# EAGLE design Amp (EAGLE 9.7.0)
SIM_ABSTOL: 1e-12; SIM_AC_SWEEP_TYPE: Dec; SIM_CHGTOL: 1e-15; SIM_GMIN: 1e-12; SIM_ITL1: 100; SIM_ITL2: 50; SIM_ITL4: 10; SIM_MAX_LIMIT: 2000; SIM_METHOD: TRAP; SIM_NUMPOINTS: 500; SIM_PIVREL: 1e-3; SIM_PIVTOL: 1e-13; SIM_RELTOL: 1e-3; SIM_RSHUNT: OFF; SIM_SRCSTEPS: 0; SIM_TEMPERATURE: 25.0; SIM_THEME: light; SIM_TRAN_AC_START: 1; SIM_TRTOL: 7; SIM_TYPE: Operating Point; SIM_VNTOL: 1e-6
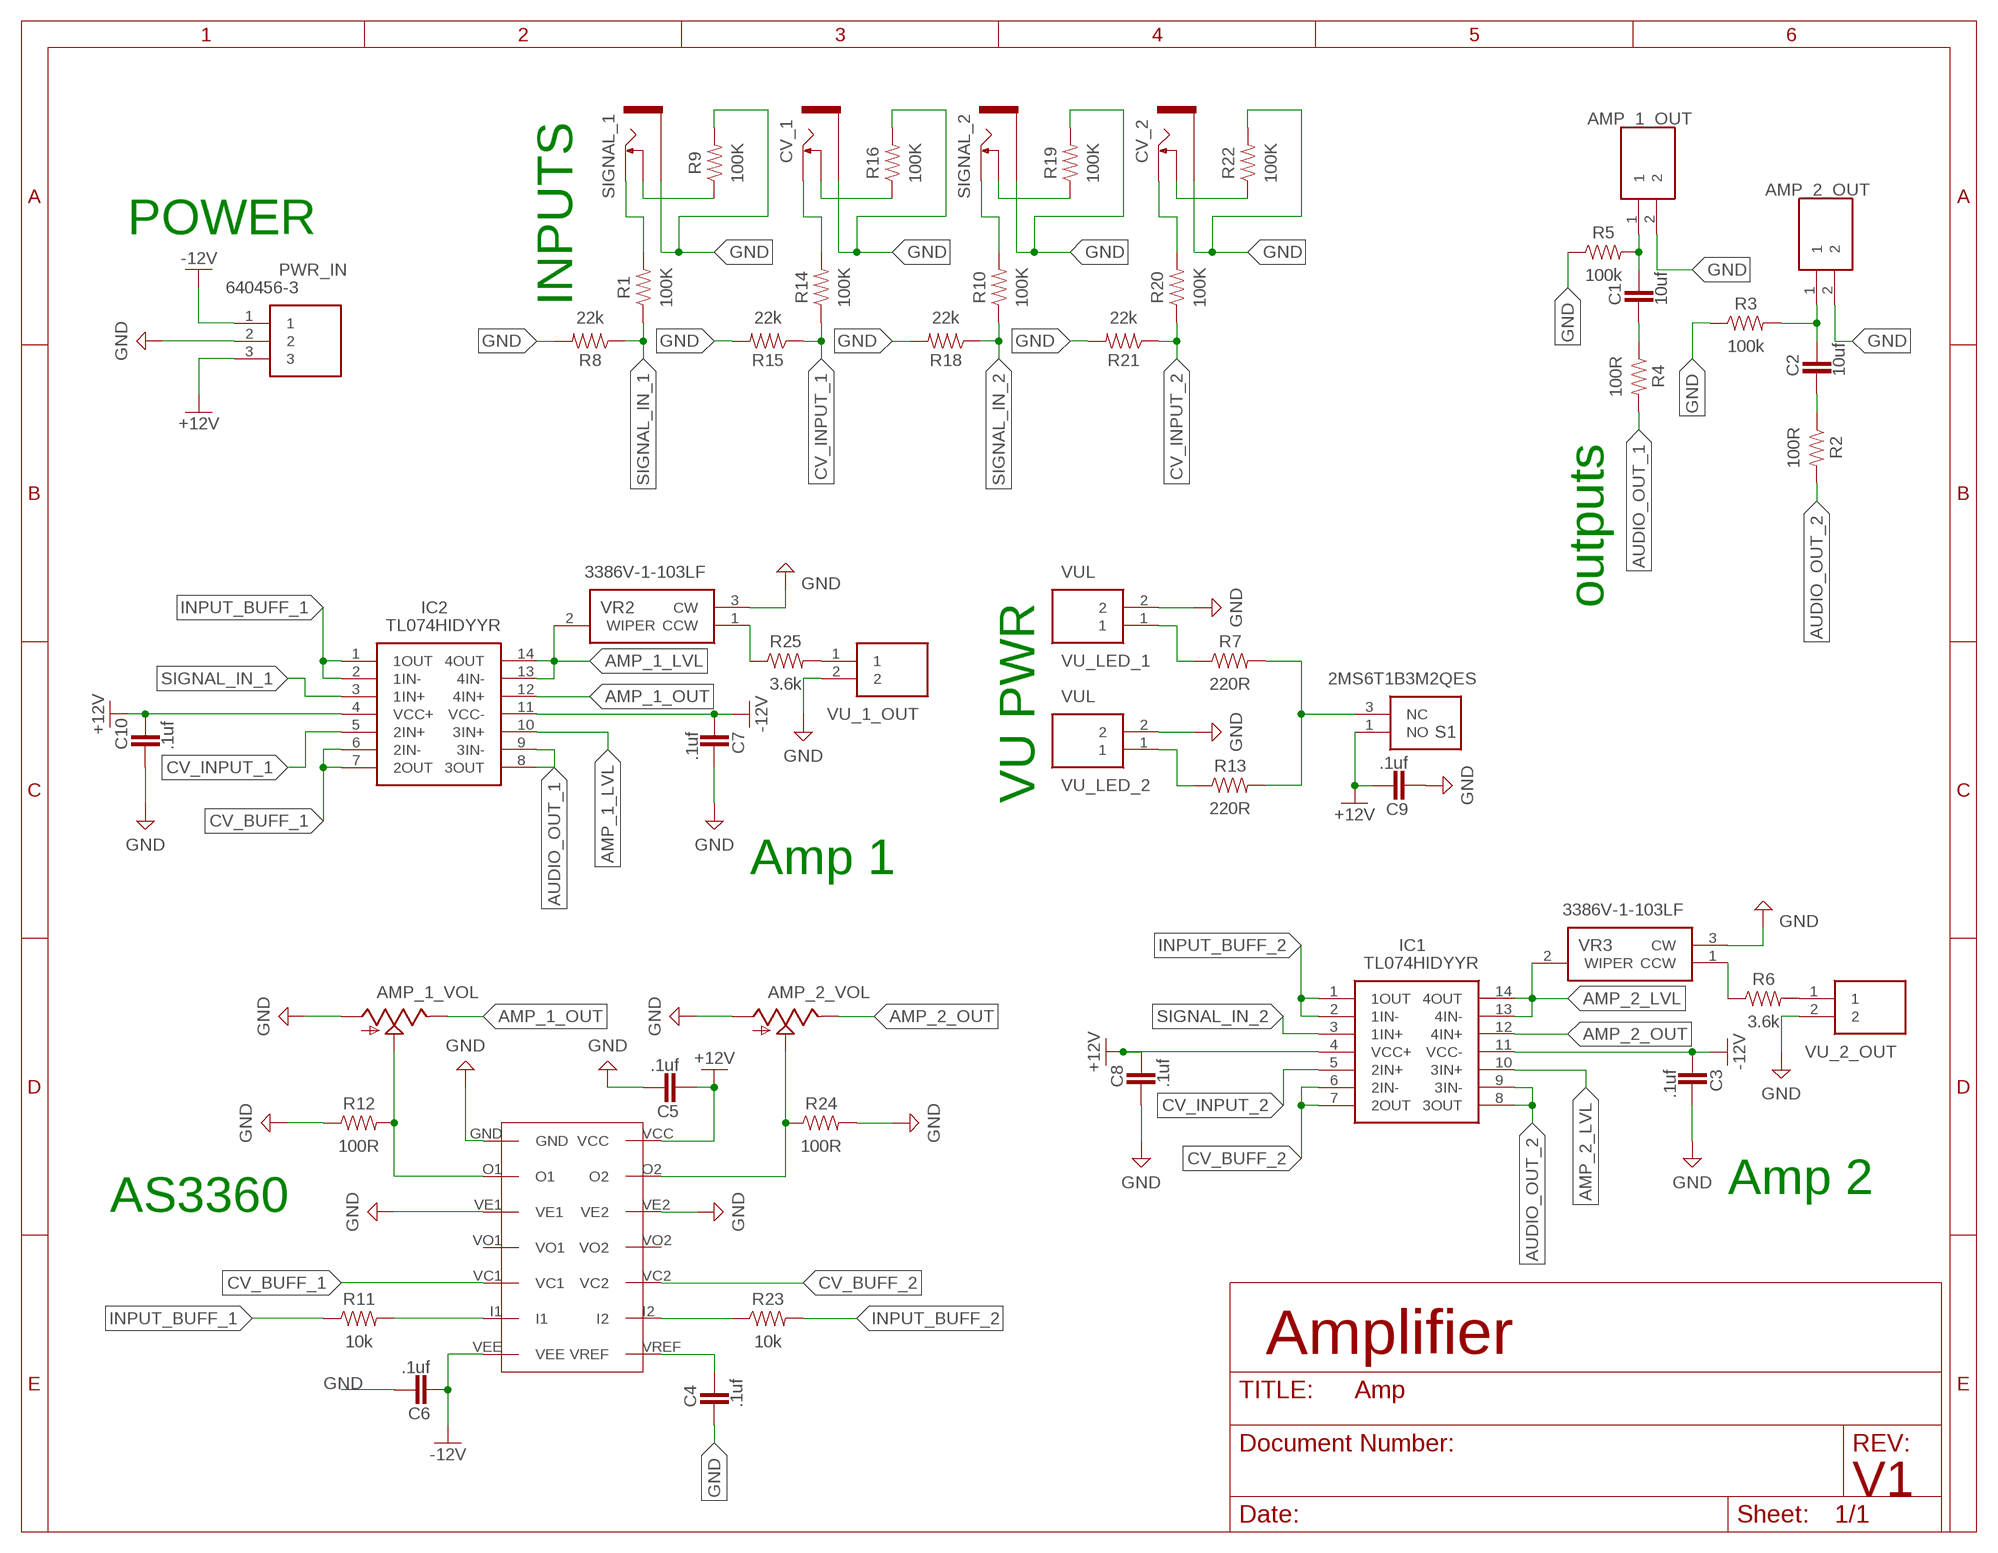
[diagram p0: schematic, sheet 1]

## Parts
AMP_1_OUT  OUT  640456-2  [SHDR2W66P0X254_1X2_508X572X104]
AMP_1_VOL  9MM_SNAP-IN_POT_  [9MM_SNAP-IN_POT]
AMP_2_OUT  OUT  640456-2  [SHDR2W66P0X254_1X2_508X572X104]
AMP_2_VOL  9MM_SNAP-IN_POT_  [9MM_SNAP-IN_POT]
C1  10uf  CAPACITOR_TANTALUM-1206(3216-METRIC)  [CAPM3216X180]
C2  10uf  CAPACITOR_TANTALUM-1206(3216-METRIC)  [CAPM3216X180]
C3  .1uf  CAPACITOR_CHIP-0402(1005-METRIC)  [CAPC1005X60]
C4  .1uf  CAPACITOR_CHIP-0402(1005-METRIC)  [CAPC1005X60]
C5  .1uf  CAPACITOR_CHIP-0402(1005-METRIC)  [CAPC1005X60]
C6  .1uf  CAPACITOR_CHIP-0402(1005-METRIC)  [CAPC1005X60]
C7  .1uf  CAPACITOR_CHIP-0402(1005-METRIC)  [CAPC1005X60]
C8  .1uf  CAPACITOR_CHIP-0402(1005-METRIC)  [CAPC1005X60]
C9  .1uf  CAPACITOR_CHIP-0402(1005-METRIC)  [CAPC1005X60]
C10  .1uf  CAPACITOR_CHIP-0402(1005-METRIC)  [CAPC1005X60]
CV_1  THONKICONNNEW  [WQP-PJ301M-12_JACK]
CV_2  THONKICONNNEW  [WQP-PJ301M-12_JACK]
IC1  TL074HIDYYR  [SOP50P326X110-14N]
IC2  TL074HIDYYR  [SOP50P326X110-14N]
PWR_IN  640456-3  [HDRV3W107P0X254_1X3_762X572X10]
R1  100K  R-US_CHIP-0402(1005-METRIC)  [RESC1005X40]
R2  100R  R-US_CHIP-0402(1005-METRIC)  [RESC1005X40]
R3  100k  R-US_CHIP-0402(1005-METRIC)  [RESC1005X40]
R4  100R  R-US_CHIP-0402(1005-METRIC)  [RESC1005X40]
R5  100k  R-US_CHIP-0402(1005-METRIC)  [RESC1005X40]
R6  3.6k  R-US_CHIP-0402(1005-METRIC)  [RESC1005X40]
R7  220R  R-US_CHIP-0402(1005-METRIC)  [RESC1005X40]
R8  22k  R-US_CHIP-0402(1005-METRIC)  [RESC1005X40]
R9  100K  R-US_CHIP-0402(1005-METRIC)  [RESC1005X40]
R10  100K  R-US_CHIP-0402(1005-METRIC)  [RESC1005X40]
R11  10k  R-US_CHIP-0402(1005-METRIC)  [RESC1005X40]
R12  100R  R-US_CHIP-0402(1005-METRIC)  [RESC1005X40]
R13  220R  R-US_CHIP-0402(1005-METRIC)  [RESC1005X40]
R14  100K  R-US_CHIP-0402(1005-METRIC)  [RESC1005X40]
R15  22k  R-US_CHIP-0402(1005-METRIC)  [RESC1005X40]
R16  100K  R-US_CHIP-0402(1005-METRIC)  [RESC1005X40]
R18  22k  R-US_CHIP-0402(1005-METRIC)  [RESC1005X40]
R19  100K  R-US_CHIP-0402(1005-METRIC)  [RESC1005X40]
R20  100K  R-US_CHIP-0402(1005-METRIC)  [RESC1005X40]
R21  22k  R-US_CHIP-0402(1005-METRIC)  [RESC1005X40]
R22  100K  R-US_CHIP-0402(1005-METRIC)  [RESC1005X40]
R23  10k  R-US_CHIP-0402(1005-METRIC)  [RESC1005X40]
R24  100R  R-US_CHIP-0402(1005-METRIC)  [RESC1005X40]
R25  3.6k  R-US_CHIP-0402(1005-METRIC)  [RESC1005X40]
S1  2MS6T1B3M2QES  [2MS6T1B3M2QES]
SIGNAL_1  THONKICONNNEW  [WQP-PJ301M-12_JACK]
SIGNAL_2  THONKICONNNEW  [WQP-PJ301M-12_JACK]
U$1  AS3360  AS33603360  [AS3360]
VR2  3386V-1-103LF  [3386V1103LF]
VR3  3386V-1-103LF  [3386V1103LF]
VU_1_OUT  VUO  640456-2  [SHDR2W66P0X254_1X2_508X572X104]
VU_2_OUT  VUO  640456-2  [SHDR2W66P0X254_1X2_508X572X104]
VU_LED_1  VUL  640456-2  [SHDR2W66P0X254_1X2_508X572X104]
VU_LED_2  VUL  640456-2  [SHDR2W66P0X254_1X2_508X572X104]

## Nets
+12V: C5.2 C8.1 C9.1 C10.1 IC1.4(VCC+) IC2.4(VCC+) PWR_IN.3 S1.1(NO) U$1.VCC
-12V: C3.2 C6.2 C7.2 IC1.11(VCC-) IC2.11(VCC-) PWR_IN.1 U$1.VEE
AMP_1_LVL: IC2.10(3IN+) IC2.13(4IN-) IC2.14(4OUT) VR2.2(WIPER)
AMP_1_OUT: AMP_1_VOL.2(S) AMP_1_VOL.3(E) IC2.12(4IN+) R12.2 U$1.O1
AMP_2_LVL: IC1.10(3IN+) IC1.13(4IN-) IC1.14(4OUT) VR3.2(WIPER)
AMP_2_OUT: AMP_2_VOL.2(S) AMP_2_VOL.3(E) IC1.12(4IN+) R24.1 U$1.O2
AUDIO_OUT_1: IC2.8(3OUT) IC2.9(3IN-) R4.2
AUDIO_OUT_2: IC1.8(3OUT) IC1.9(3IN-) R2.2
CV_BUFF_1: IC2.6(2IN-) IC2.7(2OUT) U$1.VC1
CV_BUFF_2: IC1.6(2IN-) IC1.7(2OUT) U$1.VC2
CV_INPUT_1: IC2.5(2IN+) R14.1 R15.1
CV_INPUT_2: IC1.5(2IN+) R20.1 R21.1
GND: AMP_1_OUT.2 AMP_1_VOL.1(A) AMP_2_OUT.2 AMP_2_VOL.1(A) C3.1 C4.2 C5.1 C6.1 C7.1 C8.2 C9.2 C10.2 CV_1.P$3_SLEEVE(SLEEVE) CV_2.P$3_SLEEVE(SLEEVE) PWR_IN.2 R3.1 R5.1 R8.2 R9.2 R12.1 R15.2 R16.2 R18.2 R19.2 R21.2 R22.2 R24.2 SIGNAL_1.P$3_SLEEVE(SLEEVE) SIGNAL_2.P$3_SLEEVE(SLEEVE) U$1.GND U$1.VE1 U$1.VE2 VR2.3(CW) VR3.3(CW) VU_1_OUT.2 VU_2_OUT.2 VU_LED_1.2 VU_LED_2.2
INPUT_BUFF_1: IC2.1(1OUT) IC2.2(1IN-) R11.1
INPUT_BUFF_2: IC1.1(1OUT) IC1.2(1IN-) R23.2
N$1: AMP_2_OUT.1 C2.1 R3.2
N$2: AMP_1_OUT.1 C1.1 R5.2
N$3: C1.2 R4.1
N$4: C2.2 R2.1
N$5: R13.1 VU_LED_2.1
N$6: R7.1 VU_LED_1.1
N$7: C4.1 U$1.VREF
N$8: R6.1 VR3.1(CCW)
N$9: R6.2 VU_2_OUT.1
N$10: R11.2 U$1.I1
N$12: R10.2 SIGNAL_2.P$1_TIP(TIP)
N$13: R1.2 SIGNAL_1.P$1_TIP(TIP)
N$14: R9.1 SIGNAL_1.P$2_SWITCH(SWITCH)
N$15: CV_1.P$1_TIP(TIP) R14.2
N$16: CV_1.P$2_SWITCH(SWITCH) R16.1
N$17: R19.1 SIGNAL_2.P$2_SWITCH(SWITCH)
N$18: CV_2.P$1_TIP(TIP) R20.2
N$19: CV_2.P$2_SWITCH(SWITCH) R22.1
N$20: R23.1 U$1.I2
N$21: R7.2 R13.2 S1.3(NC)
N$24: R25.2 VU_1_OUT.1
N$25: R25.1 VR2.1(CCW)
SIGNAL_IN_1: IC2.3(1IN+) R1.1 R8.1
SIGNAL_IN_2: IC1.3(1IN+) R10.1 R18.1
Unconnected: U$1.VO1 U$1.VO2

## Notes on the sheet
- POWER
- INPUTS
- outputs
- VU PWR
- Amp 1
- Amp 2
- AS3360
- Amplifier
- V1

## Library data of the parts
AMP_1_OUT AMP_2_OUT = 640456-2:640456-2: Body Features: Primary Product Color Natural | Configuration Features: Number of Positions 2 | Number of Columns 2 | PCB Mount Orientation Vertical | Number of Rows 1 | Contact Features: Contact Mating Area Length 7.49 MM | Contact Shape & Form Square | Contact Layout Inline | Contact Mating Area Plating Material Thickness 3.81 MICM | Contact Mating Area Plating Material Thickness 150 MICIN | Contact Underplating Material Thickness 1.27 MICM | Contact Mating Area Length .295 INCH | PCB Contact Termination A Source: Datasheet <http://www.te.com/commerce/DocumentDelivery/DDEController?Action=showdoc&DocId=Customer Drawing640456W3pdfEnglishENG_CD_640456_W3.pdf640456-2>; DESCRIPTION: Body Features: Primary Product Color Natural | Configuration Features: Number of Positions 2 | Number of Columns 2 | PCB Mount Orientation Vertical | Number of Rows 1 | Contact Features: Contact Mating Area Length 7.49 MM | Contact Shape & Form Square | Contact Layout Inline | Contact Mating Area Plating Material Thickness 3.81 MICM | Contact Mating Area Plating Material Thickness 150 MICIN | Contact Underplating Material Thickness 1.27 MICM | Contact Mating Area Length .295 INCH | PCB Contact Termination A; HEIGHT: 10.414mm; MANUFACTURER_NAME: TE Connectivity; MANUFACTURER_PART_NUMBER: 640456-2; MOUSER_PART_NUMBER: 571-6404562; MOUSER_PRICE-STOCK: https://www.mouser.co.uk/ProductDetail/TE-Connectivity-AMP/640456-2?qs=%2F35zJ5USjomRu3EJQJgZCQ%3D%3D; SPICEMODEL: OutputJack; SPICEMODELTEXT: *\n.subckt OutputJack 1 2\nR1 1 1_dummy 1m\nR2 2 2_dummy 1m\n.ends OutputJack; SPICEPREFIX: X
AMP_1_VOL AMP_2_VOL = MusicThingModular:9MM_SNAP-IN_POT: 9mm vertical snap-in pot, Alpha / Panasonic style; SPICEMODEL: POT10K; SPICEMODELTEXT: *\n.subckt POT10K 1 2 3\nRtop 1 2 5k\nRbot 2 3 5k\n.ends POT10K; SPICEPREFIX: X
C1-C10 = Tinkercad:CAPACITOR: Capacitor - Generic; CATEGORY: Capacitor
CV_1 CV_2 SIGNAL_1 SIGNAL_2 = MusicThingModular:THONKICONN: 3.5mm socket for Eurorack modular synths
IC1 IC2 = TL074HIDYYR:TL074HIDYYR: Operational Amplifiers - Op Amps Quad, 40-V, 5-MHz, 4-mV offset voltage, 20-V/us, In to V+ op amp with -40 C to 125 C operation Source: Datasheet <https://www.ti.com/lit/ds/symlink/tl074.pdf?HQS=dis-mous-null-mousermode-dsf-pf-null-wwe&ts=1653289518838&ref_url=https%3A%2F%2Fwww.mouser.es%2F>; DESCRIPTION: Operational Amplifiers - Op Amps Quad, 40-V, 5-MHz, 4-mV offset voltage, 20-V/us, In to V+ op amp with -40 C to 125 C operation; HEIGHT: 1.1mm; MANUFACTURER_NAME: Texas Instruments; MANUFACTURER_PART_NUMBER: TL074HIDYYR; MOUSER_PART_NUMBER: 595-TL074HIDYYR; MOUSER_PRICE-STOCK: https://www.mouser.co.uk/ProductDetail/Texas-Instruments/TL074HIDYYR?qs=Li%252BoUPsLEnudP2MOdP5hYw%3D%3D
PWR_IN = 640456-3:640456-3: Body Features: Primary Product Color Natural | Configuration Features: Number of Positions 3 | PCB Mount Orientation Vertical | Number of Rows 1 | Contact Features: Contact Current Rating (Max) 5 AMP | Contact Mating Area Plating Material Tin | Contact Underplating Material Nickel | PCB Contact Termination Area Plating Material Tin | Contact Mating Area Length 7.49 MM | Contact Underplating Material Thickness 50 MICIN | Contact Layout Inline | Contact Mating Area Length .295 INCH | Contact Base Material Cop Source: Datasheet <http://www.te.com/commerce/DocumentDelivery/DDEController?Action=showdoc&DocId=Customer Drawing640456W3pdfEnglishENG_CD_640456_W3.pdf640456-3>; DESCRIPTION: Body Features: Primary Product Color Natural | Configuration Features: Number of Positions 3 | PCB Mount Orientation Vertical | Number of Rows 1 | Contact Features: Contact Current Rating (Max) 5 AMP | Contact Mating Area Plating Material Tin | Contact Underplating Material Nickel | PCB Contact Termination Area Plating Material Tin | Contact Mating Area Length 7.49 MM | Contact Underplating Material Thickness 50 MICIN | Contact Layout Inline | Contact Mating Area Length .295 INCH | Contact Base Material Cop; HEIGHT: 10.795mm; MANUFACTURER_NAME: TE Connectivity; MANUFACTURER_PART_NUMBER: 640456-3; MOUSER_PART_NUMBER: 571-6404563; MOUSER_PRICE-STOCK: https://www.mouser.co.uk/ProductDetail/TE-Connectivity-AMP/640456-3?qs=%2F35zJ5USjonzBh%2Fz7jaWrQ%3D%3D
R1-R16 R18-R25 = Resistor:R-US: Resistor Fixed - ANSI; CATEGORY: Resistors; DESCRIPTION: Chip Resistor 1.05 X 0.54 X 0.40 mm body 0402(1005-METRIC) Package; PACKAGE_SIZE: 0402; PACKAGE_TYPE: SMD
S1 = 2MS6T1B3M2QES:2MS6T1B3M2QES: Toggle Switches SPST 2-4VDC , 1,000 M , OFF-ON 20 mmax , -40C to 85C Source: Datasheet <https://www.mouser.de/datasheet/2/979/Dailywell_01132020_2M_Series-1708785.pdf>; DESCRIPTION: Toggle Switches SPST 2-4VDC , 1,000 M , OFF-ON 20 mmax , -40C to 85C; HEIGHT: 23.63mm; MANUFACTURER_NAME: Dailywell; MANUFACTURER_PART_NUMBER: 2MS6T1B3M2QES; MOUSER_PART_NUMBER: 118-2MS6T1B3M2QES; MOUSER_PRICE-STOCK: https://www.mouser.co.uk/ProductDetail/Dailywell/2MS6T1B3M2QES?qs=B6kkDfuK7%2FCLnLIcqzvQEQ%3D%3D
U$1 = DIP762W53P254L1969H508Q14B:AS3360; SPICEMODEL: AS3360; SPICEMODELTEXT: *\n.subckt AS3360 1 2 3 4 5 6 7 8 9 10 11 12 13 14\n* Pins:\n* 1 = VE (−V)\n* 2 = IIN1\n* 3 = VREF\n* 4 = VO1\n* 5 = IO1\n* 6 = VC1\n* 7 = NC\n* 8 = VC2\n* 9 = IO2\n*10 = VO2\n*11 = VREF\n*12 = IIN2\n*13 = VE\n*14 = VS (+V)\n* Simulate left-side VCA (channel 1)\nGvca1 4 0 VALUE = { V(2) * V(6) } ; VO1 = IIN1 × VC1\n* Dummy resistors for unused pins\nRnc 7 0 1Meg\nRvc2 8 0 1Meg\nRio2 9 0 1Meg\nRvo2 10 0 1Meg\nRi2 12 0 1Meg\nRve1 1 0 1Meg\nRve2 13 0 1Meg\nRvs 14 0 1Meg\nRref1 3 0 1Meg\nRref2 11 0 1Meg\nRout1 5 0 1Meg ; IO1 not used in this sim\n.ends AS3360; SPICEPREFIX: X
VR2 VR3 = 3386V-1-103LF:3386V-1-103LF: Bourns 3386V Series Cermet Potentiometer, 10k, +/-10%, 0.5W, +/-100ppm/C, Through Hole Source: Datasheet <https://www.bourns.com/pdfs/3386.pdf>; DESCRIPTION: Bourns 3386V Series Cermet Potentiometer, 10k, +/-10%, 0.5W, +/-100ppm/C, Through Hole; HEIGHT: 9.78mm; MANUFACTURER_NAME: Bourns; MANUFACTURER_PART_NUMBER: 3386V-1-103LF; MOUSER_PART_NUMBER: 652-3386V-1-103LF; MOUSER_PRICE-STOCK: https://www.mouser.co.uk/ProductDetail/Bourns/3386V-1-103LF?qs=67cj6OzW39gv7HpWJ2tIkw%3D%3D; SPICEMODEL: POT10K; SPICEMODELTEXT: *\n.subckt POT10K 1 2 3\nRtop 1 2 5k\nRbot 2 3 5k\n.ends POT10K; SPICEPREFIX: X
VU_1_OUT VU_2_OUT = 640456-2:640456-2: Body Features: Primary Product Color Natural | Configuration Features: Number of Positions 2 | Number of Columns 2 | PCB Mount Orientation Vertical | Number of Rows 1 | Contact Features: Contact Mating Area Length 7.49 MM | Contact Shape & Form Square | Contact Layout Inline | Contact Mating Area Plating Material Thickness 3.81 MICM | Contact Mating Area Plating Material Thickness 150 MICIN | Contact Underplating Material Thickness 1.27 MICM | Contact Mating Area Length .295 INCH | PCB Contact Termination A Source: Datasheet <http://www.te.com/commerce/DocumentDelivery/DDEController?Action=showdoc&DocId=Customer Drawing640456W3pdfEnglishENG_CD_640456_W3.pdf640456-2>; DESCRIPTION: Body Features: Primary Product Color Natural | Configuration Features: Number of Positions 2 | Number of Columns 2 | PCB Mount Orientation Vertical | Number of Rows 1 | Contact Features: Contact Mating Area Length 7.49 MM | Contact Shape & Form Square | Contact Layout Inline | Contact Mating Area Plating Material Thickness 3.81 MICM | Contact Mating Area Plating Material Thickness 150 MICIN | Contact Underplating Material Thickness 1.27 MICM | Contact Mating Area Length .295 INCH | PCB Contact Termination A; HEIGHT: 10.414mm; MANUFACTURER_NAME: TE Connectivity; MANUFACTURER_PART_NUMBER: 640456-2; MOUSER_PART_NUMBER: 571-6404562; MOUSER_PRICE-STOCK: https://www.mouser.co.uk/ProductDetail/TE-Connectivity-AMP/640456-2?qs=%2F35zJ5USjomRu3EJQJgZCQ%3D%3D; SPICEMODEL: j5; SPICEMODELTEXT: *\n.subckt j5 1 2\nR1 1 1_dummy 1m\nR2 2 2_dummy 1m\n.ends j5; SPICEPREFIX: X
VU_LED_1 VU_LED_2 = 640456-2:640456-2: Body Features: Primary Product Color Natural | Configuration Features: Number of Positions 2 | Number of Columns 2 | PCB Mount Orientation Vertical | Number of Rows 1 | Contact Features: Contact Mating Area Length 7.49 MM | Contact Shape & Form Square | Contact Layout Inline | Contact Mating Area Plating Material Thickness 3.81 MICM | Contact Mating Area Plating Material Thickness 150 MICIN | Contact Underplating Material Thickness 1.27 MICM | Contact Mating Area Length .295 INCH | PCB Contact Termination A Source: Datasheet <http://www.te.com/commerce/DocumentDelivery/DDEController?Action=showdoc&DocId=Customer Drawing640456W3pdfEnglishENG_CD_640456_W3.pdf640456-2>; DESCRIPTION: Body Features: Primary Product Color Natural | Configuration Features: Number of Positions 2 | Number of Columns 2 | PCB Mount Orientation Vertical | Number of Rows 1 | Contact Features: Contact Mating Area Length 7.49 MM | Contact Shape & Form Square | Contact Layout Inline | Contact Mating Area Plating Material Thickness 3.81 MICM | Contact Mating Area Plating Material Thickness 150 MICIN | Contact Underplating Material Thickness 1.27 MICM | Contact Mating Area Length .295 INCH | PCB Contact Termination A; HEIGHT: 10.414mm; MANUFACTURER_NAME: TE Connectivity; MANUFACTURER_PART_NUMBER: 640456-2; MOUSER_PART_NUMBER: 571-6404562; MOUSER_PRICE-STOCK: https://www.mouser.co.uk/ProductDetail/TE-Connectivity-AMP/640456-2?qs=%2F35zJ5USjomRu3EJQJgZCQ%3D%3D; SPICEMODEL: j6; SPICEMODELTEXT: *\n.subckt HEADER2 1 2\nR1 1 1_dummy 1m\nR2 2 2_dummy 1m\n.ends HEADER2; SPICEPREFIX: X

## Board
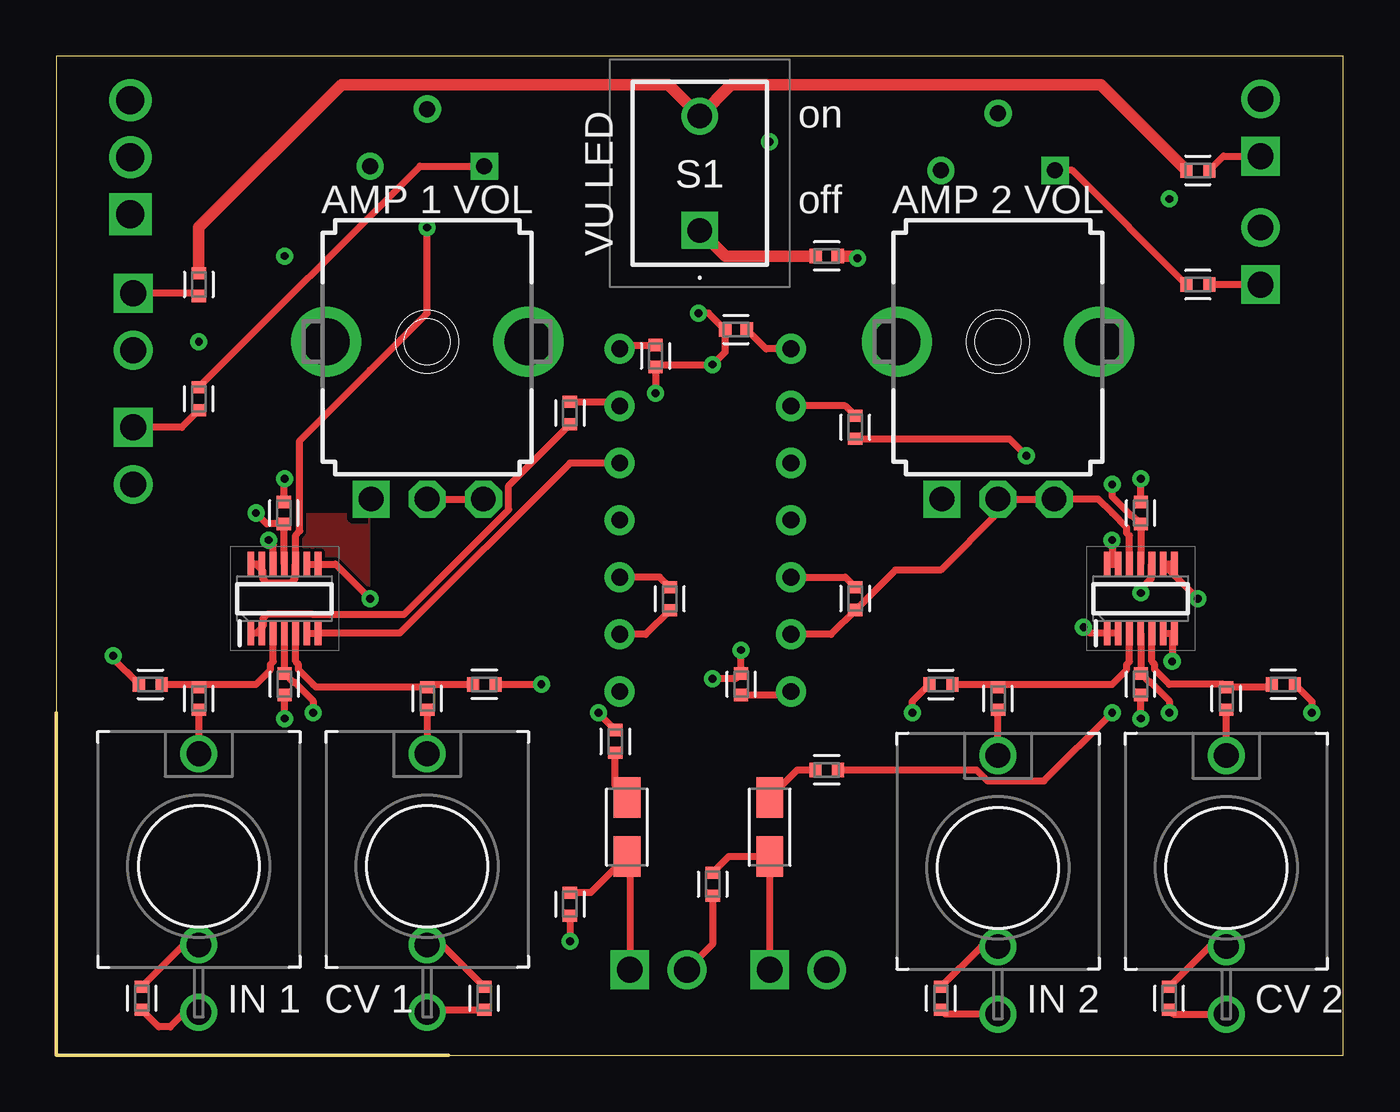
[diagram p1: board, top side]
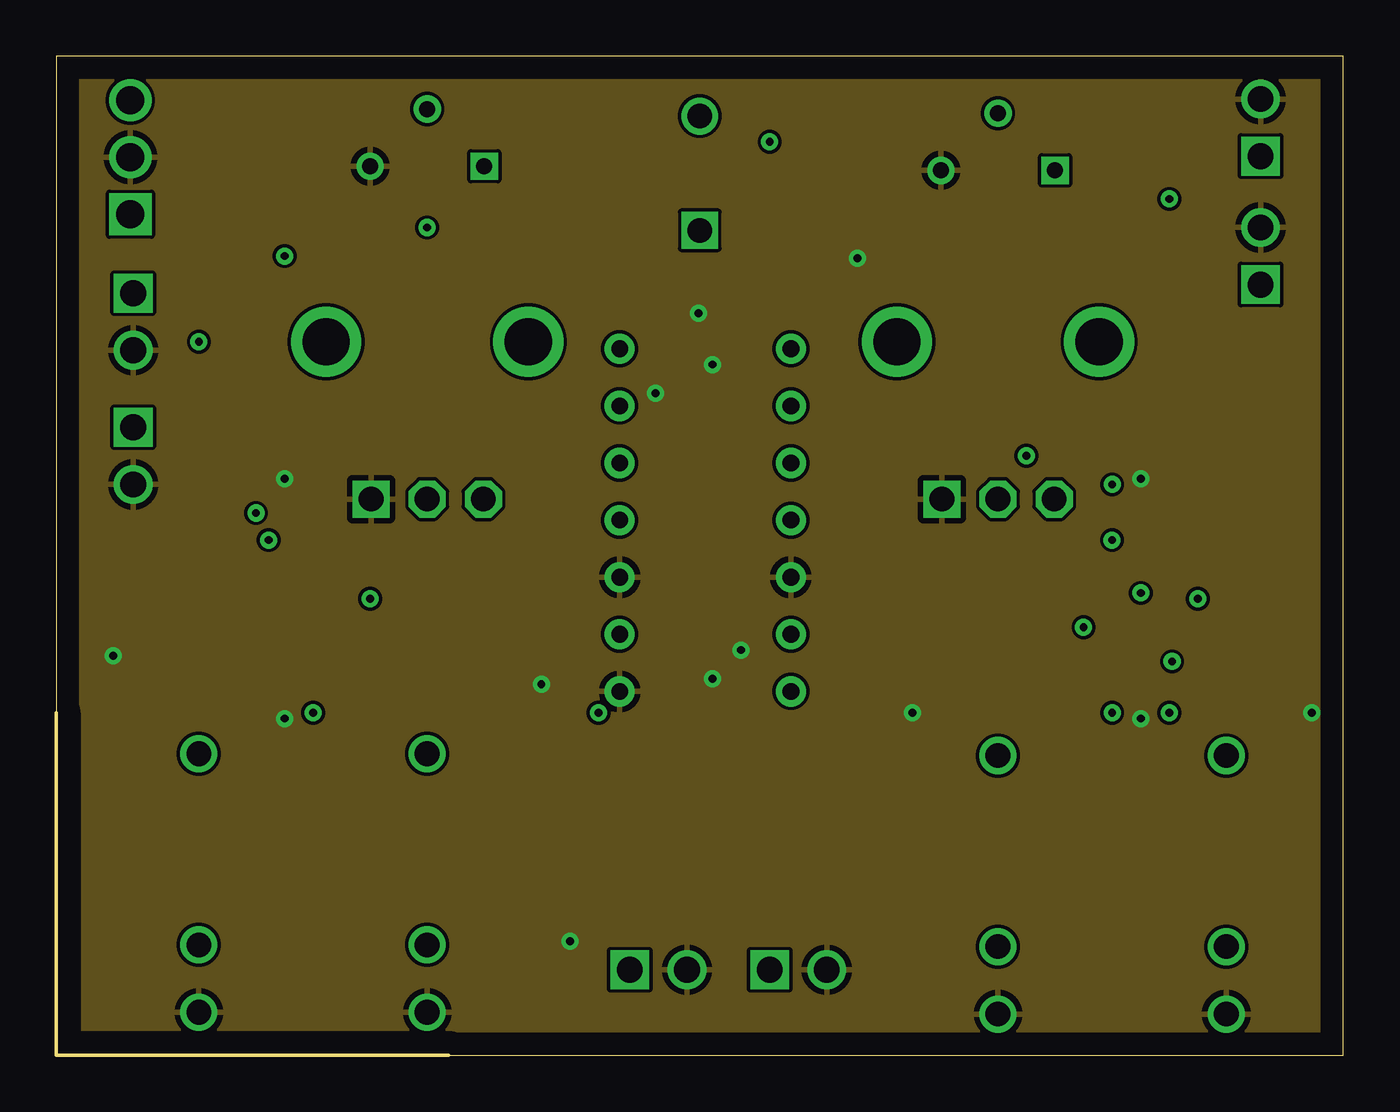
[diagram p2: board, inner layer Route2]
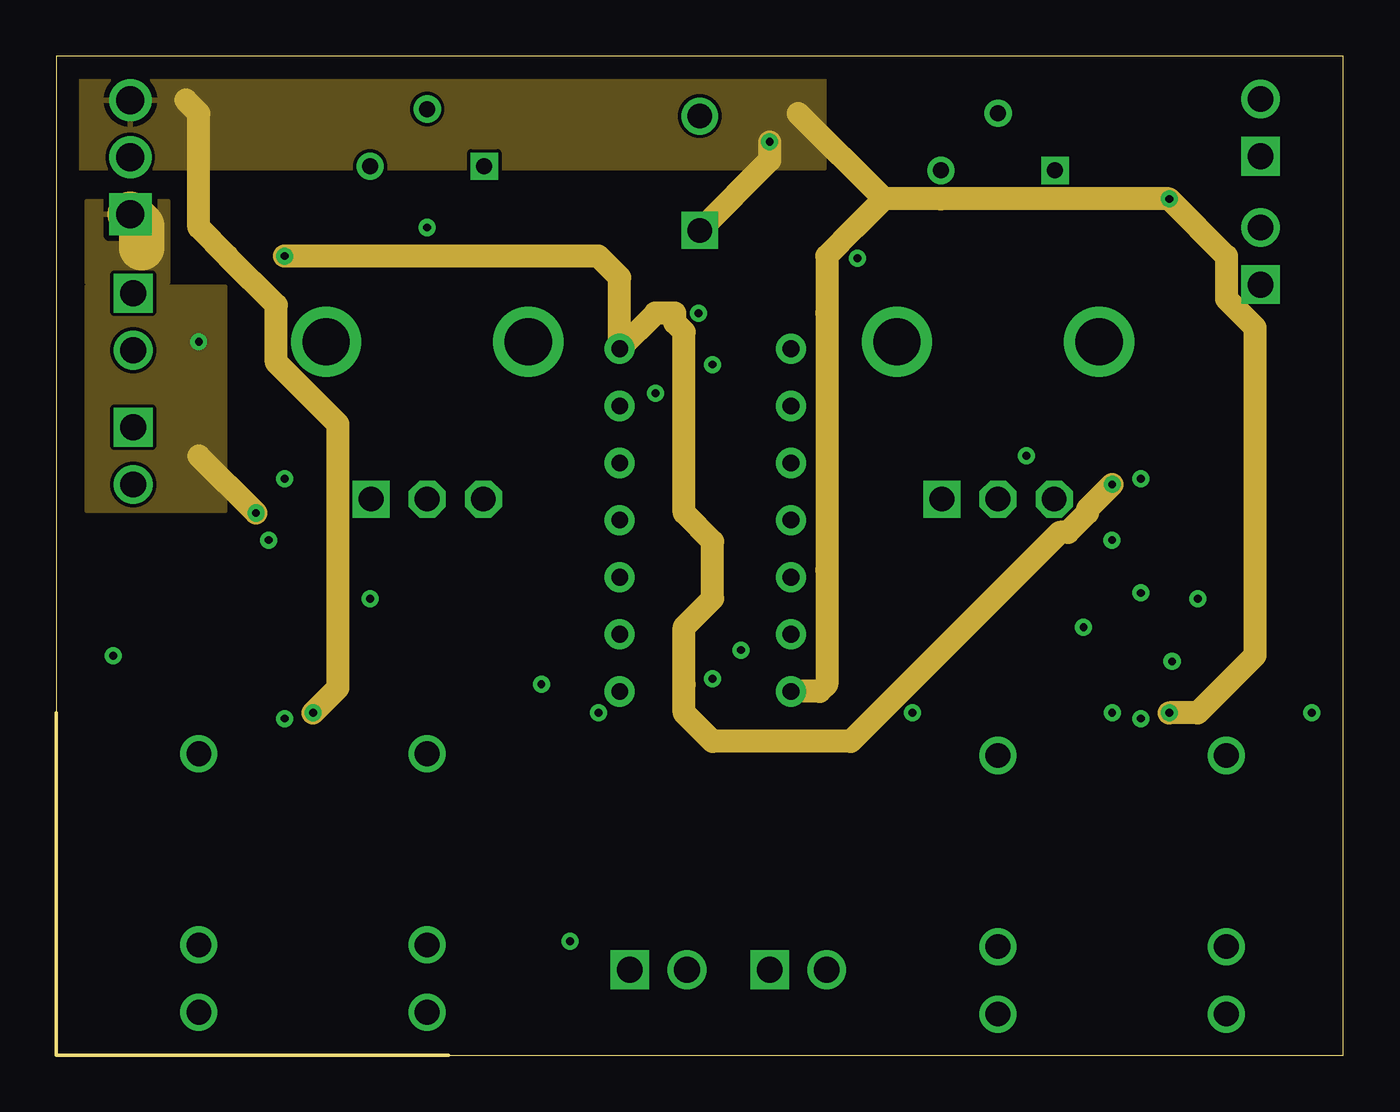
[diagram p3: board, inner layer Route15]
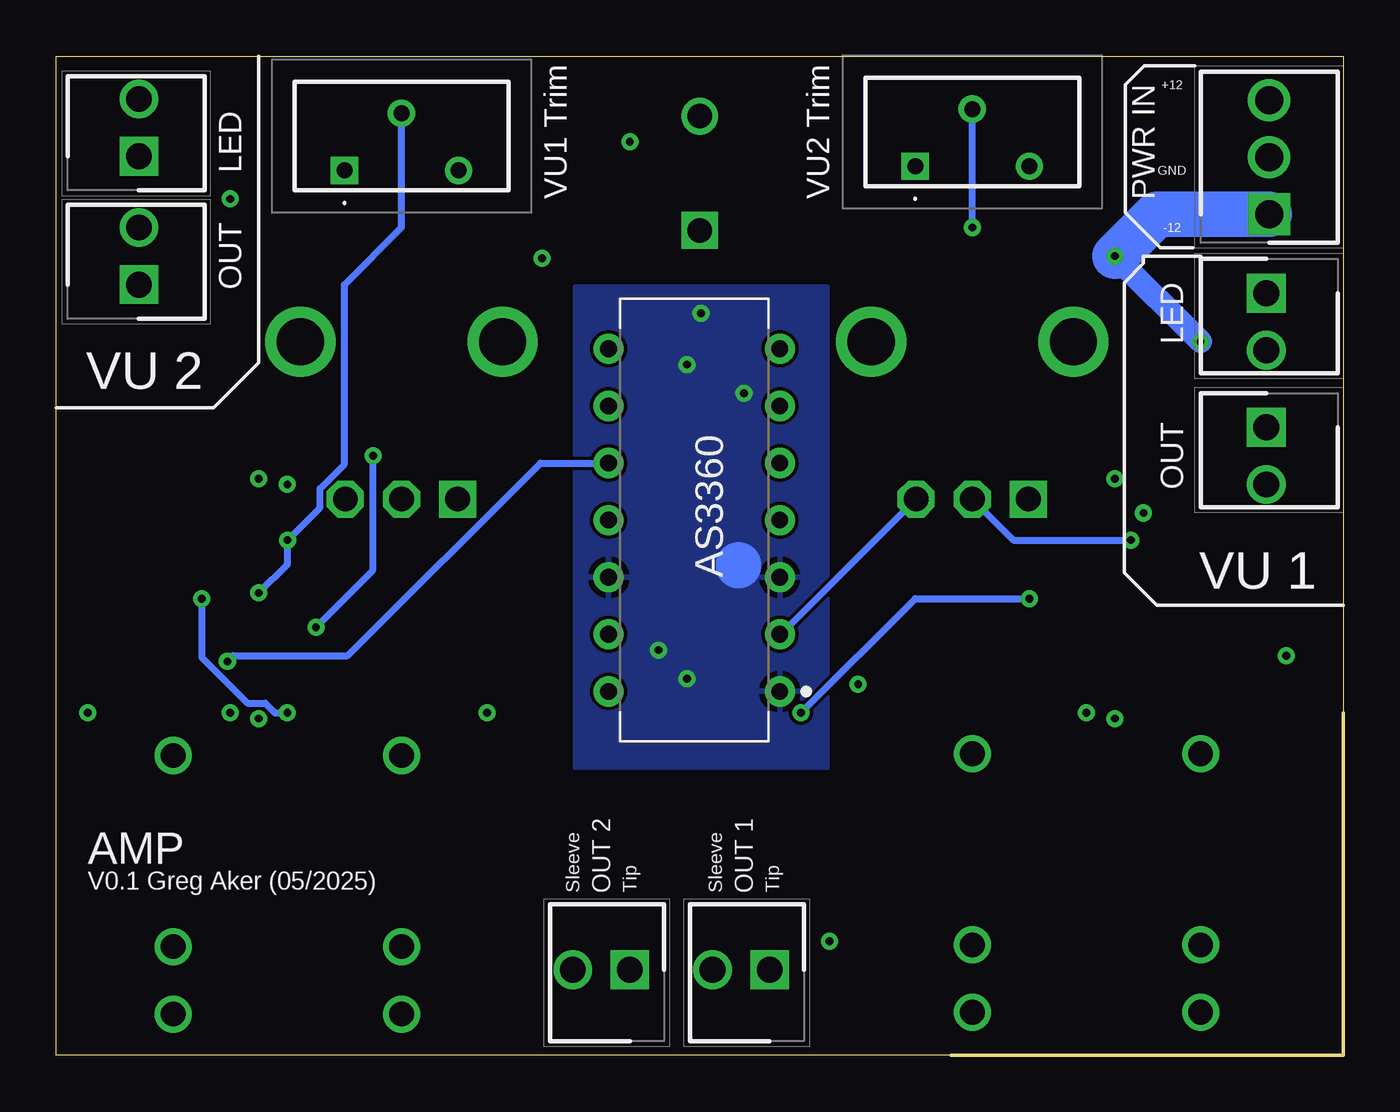
[diagram p4: board, bottom side, seen from below]

Size 57.28 x 44.45 mm. Coordinates in mm from the lower left corner, seen from the top.
Outline: 0,15.24 0,44.45 57.28,44.45 57.28,0 17.47,0 0,0 0,15.24
Outline: 0,15.14 0,15.24
Copper layers (1+2*15+16): Top 0.035mm / dielectric 1.5mm / Route2 0.035mm / dielectric 0.15mm / Route15 0.035mm / dielectric 0.2mm / Bottom 0.035mm
Design rules "Fusion Electronics Design Rules *": minimum track width 6mil, minimum drill 0.35mm, track to track 6mil, track to pad 6mil, pad to pad 6mil, via to via 6mil, smd to smd 6mil, copper to edge 40mil, drill to drill 6mil, minimum pad ring 10mil, minimum via ring 8mil, stop-mask expansion 4mil, vias tented up to drill 9999mil, thermal gap 10mil

### Footprints (pad centres in the part's own frame; a part is rotated, then mirrored left to right if it is on the bottom)
SHDR2W66P0X254_1X2_508X572X104 = drill 1.15 pad 1.725 square: 1 0,0 | drill 1.15 pad 1.725: 2 -2.54,0
9MM_SNAP-IN_POT = drill 1.1 square: 1 -2.5,-7 | drill 1.1 octagon: 2 0,-7; 3 2.5,-7 | drill 2.1 pad 2.794: CHASSIS1 -4.5,0; CHASSIS2 4.5,0
CAPM3216X180 = smd 1.796 x 1.189: 1 -1.31,0; 2 1.31,0
CAPC1005X60 = smd 0.56 x 0.629: 1 -0.485,0; 2 0.485,0
WQP-PJ301M-12_JACK = drill 1.1: P$1_TIP 0,5; P$2_SWITCH 0,-3.5; P$3_SLEEVE 0,-6.5
SOP50P326X110-14N = smd 1.075 x 0.3: 1 -1.538,1.5; 2 -1.538,1; 3 -1.538,0.5; 4 -1.538,0; 5 -1.538,-0.5; 6 -1.538,-1; 7 -1.538,-1.5; 8 1.538,-1.5; 9 1.538,-1; 10 1.538,-0.5; 11 1.538,0; 12 1.538,0.5; 13 1.538,1; 14 1.538,1.5
HDRV3W107P0X254_1X3_762X572X10 = drill 1.25 pad 1.875 square: 1 0,0 | drill 1.25 pad 1.875: 2 2.54,0; 3 5.08,0
RESC1005X40 = smd 0.535 x 0.644: 1 -0.507,0; 2 0.507,0
2MS6T1B3M2QES = drill 1.09 pad 1.635 square: 1 0,0 | drill 1.09 pad 1.635: 3 0,5.08
AS3360 = drill 0.743 pad 1.343: GND -3.81,7.62; I1 -3.81,-5.08; I2 3.81,-5.08; O1 -3.81,5.08; O2 3.81,5.08; VC1 -3.81,-2.54; VC2 3.81,-2.54; VCC 3.81,7.62; VE1 -3.81,2.54; VE2 3.81,2.54; VEE -3.81,-7.62; VO1 -3.81,0; VO2 3.81,0; VREF 3.81,-7.62
3386V1103LF = drill 0.71 pad 1.217 square: 1 0,0 | drill 0.71 pad 1.217: 2 2.54,2.54; 3 5.08,0

### Placement (x,y rotation side)
AMP_1_OUT  25.53,3.81 0 bottom
AMP_1_VOL  16.51,31.75 0 top
AMP_2_OUT  31.75,3.81 0 bottom
AMP_2_VOL  41.91,31.75 0 top
C1  25.4,10.16 90 top
C2  31.75,10.16 90 top
C3  48.26,24.13 270 top
C4  30.25,32.29 180 top
C5  30.48,16.51 270 top
C6  26.67,31.11 90 top
C7  10.13,24.13 270 top
C8  48.26,16.51 270 top
C9  34.29,35.56 0 top
C10  10.16,16.51 270 top
CV_1  16.51,8.42 0 top
CV_2  52.07,8.34 0 top
IC1  48.26,20.32 90 top
IC2  10.16,20.32 90 top
PWR_IN  3.3,37.42 90 bottom
R1  6.35,15.88 270 top
R2  34.29,12.7 0 top
R3  29.21,7.62 90 top
R4  24.88,13.97 90 top
R5  22.86,6.73 90 top
R6  50.8,34.29 0 top
R7  6.35,34.29 90 top
R8  4.19,16.51 180 top
R9  3.81,2.54 270 top
R10  41.91,15.88 270 top
R11  22.86,28.57 90 top
R12  27.3,20.32 270 top
R13  50.8,39.37 180 top
R14  16.51,15.88 270 top
R15  19.05,16.51 0 top
R16  19.05,2.54 270 top
R18  39.37,16.51 180 top
R19  39.37,2.54 270 top
R20  52.07,15.88 270 top
R21  54.61,16.51 0 top
R22  49.53,2.54 270 top
R23  35.56,27.94 270 top
R24  35.56,20.32 90 top
R25  6.35,29.21 270 top
S1  28.64,36.7 0 top
SIGNAL_1  6.35,8.42 0 top
SIGNAL_2  41.91,8.34 0 top
U$1  28.88,23.81 180 bottom
VR2  19.05,39.56 0 bottom
VR3  44.45,39.37 0 bottom
VU_1_OUT  3.43,27.94 90 bottom
VU_2_OUT  53.59,34.29 270 bottom
VU_LED_1  3.43,33.91 90 bottom
VU_LED_2  53.59,40.01 270 bottom

### Tracks (layer width: path | path; a pad name or v marks a point on that pad's centre or on a via)
+12V  (via drill 0.35)
  Top 0.305: IC2.4 C10.1 10.54,16.61 10.6,16.61 11.43,15.78 v11.43,15.24 | IC1.4 C8.1 48.64,16.61 48.7,16.61 49.53,15.78 v49.53,15.24 | U$1.VCC 32.53,16.02 C5.2
  Top 0.508: C9.1 29.78,35.56 S1.1
  Route15 1.016: 36.83,38.1 39.37,38.1 v49.53,38.1 52.07,35.56 52.07,33.66 53.34,32.39 53.34,20.32 53.34,17.78 50.8,15.24 v49.53,15.24 | 33.02,41.91 36.83,38.1 | 36.83,38.1 35.56,36.83 34.29,35.56 34.29,33.02 34.29,21.59 34.29,16.51 33.97,16.19 U$1.VCC | v11.43,15.24 12.53,16.34 12.53,28.1 9.79,30.83 9.79,33.39 7.62,35.56 6.35,36.83 6.35,41.91 5.76,42.5 | v31.75,40.64 31.75,39.81 S1.1
  pour Route15: 0.08,39.45 34.21,39.45 34.21,45.64 0.08,45.64
-12V  (via drill 0.35)
  Top 0.305: IC2.11 10.13,21.89 C7.2 9.37,23.65 v8.89,24.13 | IC1.11 C3.2 47.88,24.03 47.82,24.03 46.99,24.86 v46.99,25.4 | U$1.VEE 25.24,31.6 C6.2
  Route15 1.016: v10.16,35.56 24.13,35.56 25.07,34.62 U$1.VEE 26.66,33.02 27.54,33.02 27.54,32.59 27.94,32.19 27.94,24.13 29.21,22.86 29.21,20.32 27.94,19.05 27.94,16.51 27.94,15.24 29.21,13.97 35.36,13.97 36.63,15.24 44.66,23.27 45.02,23.27 45.9,24.14 45.9,24.3 v46.99,25.4 | v8.89,24.13 6.35,26.67
  Route15 2.032: PWR_IN.1 3.81,36.91 3.81,35.94
  Bottom 1.016: v10.16,35.56 v6.35,31.75
  Bottom 2.032: PWR_IN.1 8.3,37.42 v10.16,35.56
  pour Route15: 1.35,24.21 7.54,24.21 7.54,34.21 1.35,34.21
  pour Route15: 1.35,34.37 5,34.37 5,38.02 1.35,38.02
AMP_1_LVL  (via drill 0.35)
  Top 0.305: IC2.13 8.89,21.86 | 8.89,21.86 IC2.14 | 8.89,21.86 9.21,21.54 9.21,21.19 9.38,21.02 10.44,21.02 10.62,21.2 10.62,21.82 IC2.10 10.66,23.15 10.84,23.33 10.84,27.35 13.97,30.48 16.51,33.02 v16.51,36.83
  Bottom 0.305: v16.51,36.83 VR2.2
AMP_1_OUT  (via drill 0.35)
  Top 0.305: AMP_1_VOL.2 AMP_1_VOL.3 | R12.2 26.23,18.73 U$1.O1 | IC2.12 9.66,22.72 v9.45,22.93
  Bottom 0.305: U$1.O1 25.03,18.73 AMP_1_VOL.3 | AMP_1_VOL.2 14.69,22.93 v9.45,22.93
AMP_2_LVL  (via drill 0.35)
  Top 0.305: 46.99,21.86 IC1.13 | IC1.14 46.99,21.86 | v46.99,22.93 v46.99,22.92 46.99,21.86 | IC1.10 48.72,21.82 48.72,21.2 48.26,20.74 v48.26,20.57
  Bottom 0.305: VR3.2 41.91,36.83 44.45,34.29 44.45,26.31 45.54,25.22 45.54,24.37 v46.99,22.93 46.99,21.85 v48.26,20.57
AMP_2_OUT
  Top 0.305: IC1.12 47.76,23.12 47.64,23.24 47.64,23.48 46.99,24.13 46.37,24.75 AMP_2_VOL.3 AMP_2_VOL.2 41.91,24.13 39.37,21.59 37.34,21.59 R24.1 | R24.1 34.48,18.73 U$1.O2 | R24.1
AUDIO_OUT_1  (via drill 0.35)
  Top 0.305: IC2.9 IC2.8 12.43,21.86 v13.97,20.32 | R4.2 24.13,15.23 v24.13,15.24
  Bottom 0.305: v24.13,15.24 19.05,20.32 v13.97,20.32
AUDIO_OUT_2  (via drill 0.35)
  Top 0.305: IC1.8 49.53,21.86 | 49.53,21.86 IC1.9 | R2.2 40.95,12.7 41.44,12.21 43.96,12.21 v46.99,15.24 | v50.8,20.32 49.53,21.59 49.53,21.86
  Bottom 0.305: v50.8,20.32 50.8,17.78 50.8,17.7 48.77,15.67 47.98,15.67 47.55,15.24 v46.99,15.24
CV_BUFF_1
  Top 0.305: IC2.6 IC2.7 15.29,18.78 22.86,26.35 U$1.VC1
CV_BUFF_2  (via drill 0.35)
  Top 0.305: IC1.6 IC1.7 49.66,18.68 v49.66,17.53
  Bottom 0.305: v49.66,17.53 49.4,17.78 44.3,17.78 35.73,26.35 U$1.VC2
CV_INPUT_1
  Top 0.305: R15.1 16.64,16.51 R14.1 11.56,16.38 11.43,16.51 10.78,17.16 10.78,17.4 10.66,17.52 IC2.5
CV_INPUT_2
  Top 0.305: IC1.5 48.76,17.52 48.88,17.4 48.88,17.16 49.53,16.51 51.94,16.51 R20.1 53.98,16.38 R21.1
GND  (via drill 0.35)
  Top 0.305: v10.16,14.99 C10.2 | C7.1 10.13,25.63 v10.16,25.65 | SIGNAL_1.P$3_SLEEVE 5.73,1.92 5.08,1.27 4.57,1.27 R9.2 | 16.62,2.03 CV_1.P$3_SLEEVE 16.62,2.03 | SIGNAL_2.P$3_SLEEVE 39.56,1.84 R19.2 | R22.2 49.72,1.84 CV_2.P$3_SLEEVE | R5.1 v22.86,5.08 | R3.1 29.21,4.95 AMP_1_OUT.2 | v30.48,18.03 C5.1 30.25,16.76 v29.21,16.76 | v26.67,29.46 C6.1 26.77,30.73 v29.21,30.73 29.77,31.29 C4.2 29.04,33.02 v28.57,33.02 | R8.2 2.54,17.65 v2.54,17.78 | R15.2 v21.59,16.51 | v48.26,14.99 C8.2 | C3.1 v48.26,25.65 | v38.1,15.24 38.1,15.75 R18.2 | R21.2 55.88,15.75 v55.88,15.24 | R12.1 26.86,21.27 U$1.VE1 | U$1.VE2 35.11,21.27 R24.2 | 16.62,2.03 R16.2
  Top 0.508: C9.2 35.56,35.56 v35.66,35.46
  Bottom 2.032: 26.91,21.83 26.91,21.78
  pour Route2: -2.46,-3.73 59.61,-3.73 59.61,46.91 -2.46,46.91
  pour Top: 44.53,16.59 51.99,16.59 51.99,24.05 44.53,24.05
  pour Top: 6.43,16.59 13.89,16.59 13.89,24.05 6.43,24.05
  pour Bottom: 22.94,12.78 34.21,12.78 34.21,34.21 22.94,34.21
INPUT_BUFF_1
  Top 0.305: IC2.2 8.89,18.78 | 8.89,18.78 IC2.1 | R11.1 20.14,25.35 20.14,24.28 15.48,19.62 11.43,19.62 9.38,19.62 9.21,19.45 9.21,19.1 8.89,18.78
INPUT_BUFF_2  (via drill 0.35)
  Top 0.305: IC1.2 IC1.1 45.99,18.78 v45.72,19.05 | R23.2 42.42,27.43 v43.18,26.67
  Bottom 0.305: v45.72,19.05 43.18,21.59 v43.18,26.67
N$1
  Top 0.305: AMP_2_OUT.1 C2.1 29.93,8.85 R3.2
N$2
  Top 0.305: AMP_1_OUT.1 25.53,8.72 C1.1 23.79,7.24 R5.2
N$3
  Top 0.305: C1.2 24.88,11.99 R4.1
N$4
  Top 0.305: C2.2 32.98,12.7 R2.1
N$5
  Top 0.305: R13.1 51.94,40.01 VU_LED_2.1
N$6
  Top 0.305: VU_LED_1.1 6.22,33.91 R7.1
N$7
  Top 0.305: U$1.VREF 31.59,31.43 C4.1
N$8
  Top 0.305: R6.1 45.21,39.37 VR3.1
N$9
  Top 0.305: VU_2_OUT.1 R6.2
N$10
  Top 0.305: U$1.I1 24.89,29.08 R11.2
N$12
  Top 0.305: SIGNAL_2.P$1_TIP R10.2
N$13
  Top 0.305: R1.2 SIGNAL_1.P$1_TIP
N$14
  Top 0.305: R9.1 5.68,4.92 SIGNAL_1.P$2_SWITCH
N$15
  Top 0.305: R14.2 CV_1.P$1_TIP
N$16
  Top 0.305: R16.1 17.18,4.92 CV_1.P$2_SWITCH
N$17
  Top 0.305: R19.1 41.16,4.84 SIGNAL_2.P$2_SWITCH
N$18
  Top 0.305: CV_2.P$1_TIP R20.2
N$19
  Top 0.305: R22.1 51.32,4.84 CV_2.P$2_SWITCH
N$20
  Top 0.305: R23.1 35.11,28.89 U$1.I2
N$21
  Top 0.508: R13.2 46.48,43.18 44.45,43.18 30.04,43.18 S1.3 27.24,43.18 12.7,43.18 6.35,36.83 R7.2
N$24
  Top 0.305: R25.2 5.59,27.94 VU_1_OUT.1
N$25
  Top 0.305: R25.1 16.19,39.56 VR2.1
SIGNAL_IN_1
  Top 0.305: R8.1 6.22,16.51 R1.1 6.48,16.51 8.89,16.51 9.54,17.16 9.54,17.4 9.66,17.52 IC2.3
SIGNAL_IN_2
  Top 0.305: R18.1 41.78,16.51 R10.1 42.04,16.51 46.99,16.51 47.64,17.16 47.64,17.4 47.76,17.52 IC1.3

### Text on the board
tPlace: on | AMP 1 VOL | off | AMP 2 VOL | VU LED | IN 1 | CV 1 | IN 2 | CV 2
bPlace: +12 | PWR IN | LED | GND | VU2 Trim | VU1 Trim | -12 | OUT | LED | VU 2 | OUT | VU 1 | OUT 1 | OUT 2 | AMP | Tip | Sleeve | Tip | Sleeve | V0.1 Greg Aker (05/2025)